# Altium schematic sheet Power_Unit.SchDoc
size A4
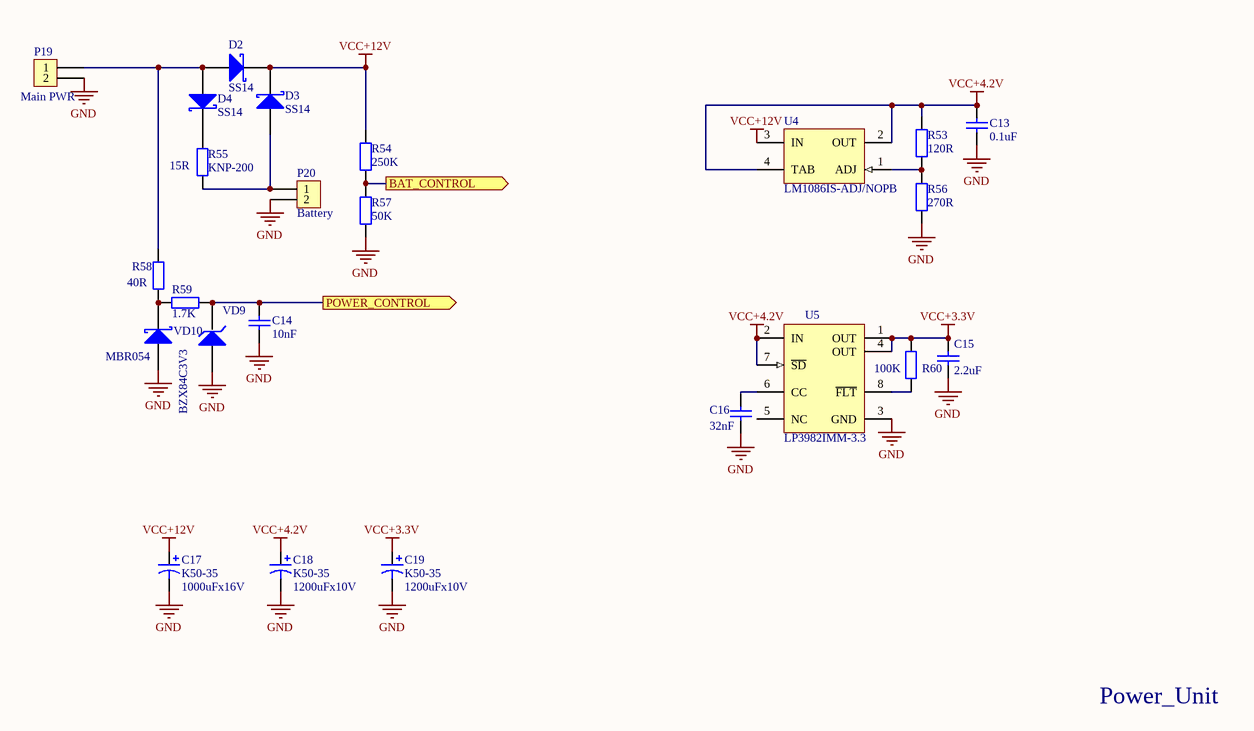
[diagram p0: Power_Unit.SchDoc]

## Parts
C13  value 0.1uF  [C0603]  (hidden comment: CAP_SMD)
C14  value 10nF  [C0603]  (hidden comment: 0805)
C15  value 2.2uF  [C0603]  (hidden comment: 0805)
C16  value 32nF  [C0603]  (hidden comment: 0805)
C17  K50-35  value 1000uFx16V  [CAP_POL_D10]
C18  K50-35  value 1200uFx10V  [CAP_POL_D10]
C19  K50-35  value 1200uFx10V  [CAP_POL_D10]
D2  SS14  [SMA_Diode]
D3  SS14  [SMA_Diode]
D4  SS14  [SMA_Diode]
P19  Main PWR  [WF 02M]
P20  Battery  [WF 02M]
R53  value 120R  [C0805]  (hidden comment: RES)
R54  value 250K  [C0603]  (hidden comment: RES_SMD)
R55  KNP-200  value 15R  [Resistor KNP-200]
R56  value 270R  [C0805]  (hidden comment: RES)
R57  value 50K  [C0603]  (hidden comment: RES_SMD)
R58  value 40R  [C0805]  (hidden comment: RES)
R59  value 1.7K  [C0805]  (hidden comment: RES)
R60  value 100K  [C0603]  (hidden comment: RES)
U4  LM1086IS-ADJ/NOPB  [TS3B_N]
U5  LP3982IMM-3.3  [MUA08A_N]
VD9  BZX84C3V3  [SOT23]
VD10  MBR054  [SOD-123]

## Ports
BAT_CONTROL (out), POWER_CONTROL (out)

## Nets
GND: C13.2 C14.2 C15.2 C16.2 C17.2 C18.2 C19.2 P19.2 P20.2 R56.1 R57.1 U5.3(GND) VD9.1(A) VD10.2(A)
VCC+3.3V: C15.1 C19.1 R60.2 U5.1(OUT) U5.4(OUT)
VCC+4.2V: C13.1 C18.1 R53.2 U4.2(OUT) U4.4(TAB) U5.2(IN) U5.7(~{SD})
VCC+12V: C17.1 D2.1(K) D3.1(K) R54.2 U4.3(IN)
BAT_CONTROL: R54.1 R57.2 ; port BAT_CONTROL
POWER_CONTROL: C14.1 R59.2 VD9.3(K) ; port POWER_CONTROL
NetC16_1: C16.1 U5.6(CC)
NetD2_2: D2.2(A) D4.2(A) P19.1 R58.2
NetD3_2: D3.2(A) P20.1 R55.1
NetD4_1: D4.1(K) R55.2
NetR53_1: R53.1 R56.2 U4.1(ADJ)
NetR58_1: R58.1 R59.1 VD10.1(K)
NetR60_1: R60.1 U5.8(~{FLT})

Not connected (* = marked no-connect by the designer): U5 5(NC); VD9 2

## Notes on the sheet
- Power_Unit

## Library data of the parts
C13-C16 = Capasitor_SMD_0805: Capasitor_SMD_0808/
C17-C19 = Capasitor_pol D10
P19 P20 = WF 02M
R53 R54 R56-R60 = RES: Resistor
R55 = Resistor 2W
U4 = LM1086IS-ADJ/NOPB: 1.5A Low Dropout Positive Regulators, 3-pin TO-263, Pb-Free; Manufacturer: National Semiconductor; PackageTopMarking: NSUZXYTTE#*LM1086*IS-ADJ; PowerWise: N; CompType: LDO IC; Published: 1-Mar-2010; DatasheetVersion: Jun-2005; PackageVersion: revF, Apr-2005; PackageReference: TS3B; Publisher: Altium Limited; PackageDescription: TO-263, Molded, .400 x .390 x .180in, 3 Lead, .1in Pitch, Surface Mount; Supplier 1: Digi-Key; Supplier Part Number 1: LM1086IS-ADJ-ND; Supplier 2: Farnell; Supplier Part Number 2: 1469045; PartNumber: LM1086IS-ADJ/NOPB; RoHS: Y; PinCount: 3; Code_JEDEC: MO-169-AA; ComponentLink1Description: LM1086 Datasheet; ComponentLink1URL: http://www.national.com/ds/LM/LM1086.pdf; ComponentLink2Description: LM1086 Web Page; ComponentLink2URL: http://www.national.com/pf/LM/LM1086.html; ComponentLink3Description: TS3B Package Page; ComponentLink3URL: http://www.national.com/packaging/folders/ts3b.html
U5 = LP3982IMM-3.3: Micropower, Ultra Low-Dropout, Low-Noise, 300mA CMOS Regulator, 8-pin Mini SOIC; Manufacturer: National Semiconductor; PackageTopMarking: ZXTT*LEUB; PowerWise: N; CompType: LDO IC; Published: 4-Dec-2008; DatasheetVersion: Mar-2006; PackageVersion: revF, Apr-2008; PackageReference: MUA08A; Publisher: Altium Limited; PackageDescription: MINI SOIC, .118 x .118 x .034in, 8 Lead, .0256in Pitch; Supplier 1: Farnell; Supplier Part Number 1: 9779590; PartNumber: LP3982IMM-3.3; RoHS: N; PinCount: 8; Code_JEDEC: MO-187-AA; ComponentLink1Description: LP3982 Datasheet; ComponentLink1URL: http://www.national.com/ds/LP/LP3982.pdf; ComponentLink2Description: LP3982 Web Page; ComponentLink2URL: http://www.national.com/pf/LP/LP3982.html; ComponentLink3Description: MUA08A Package Page; ComponentLink3URL: http://www.national.com/packaging/folders/mua08a.html
VD9 = BZX84C: Value: *